# EAGLE design GAME (EAGLE 6.5.0)
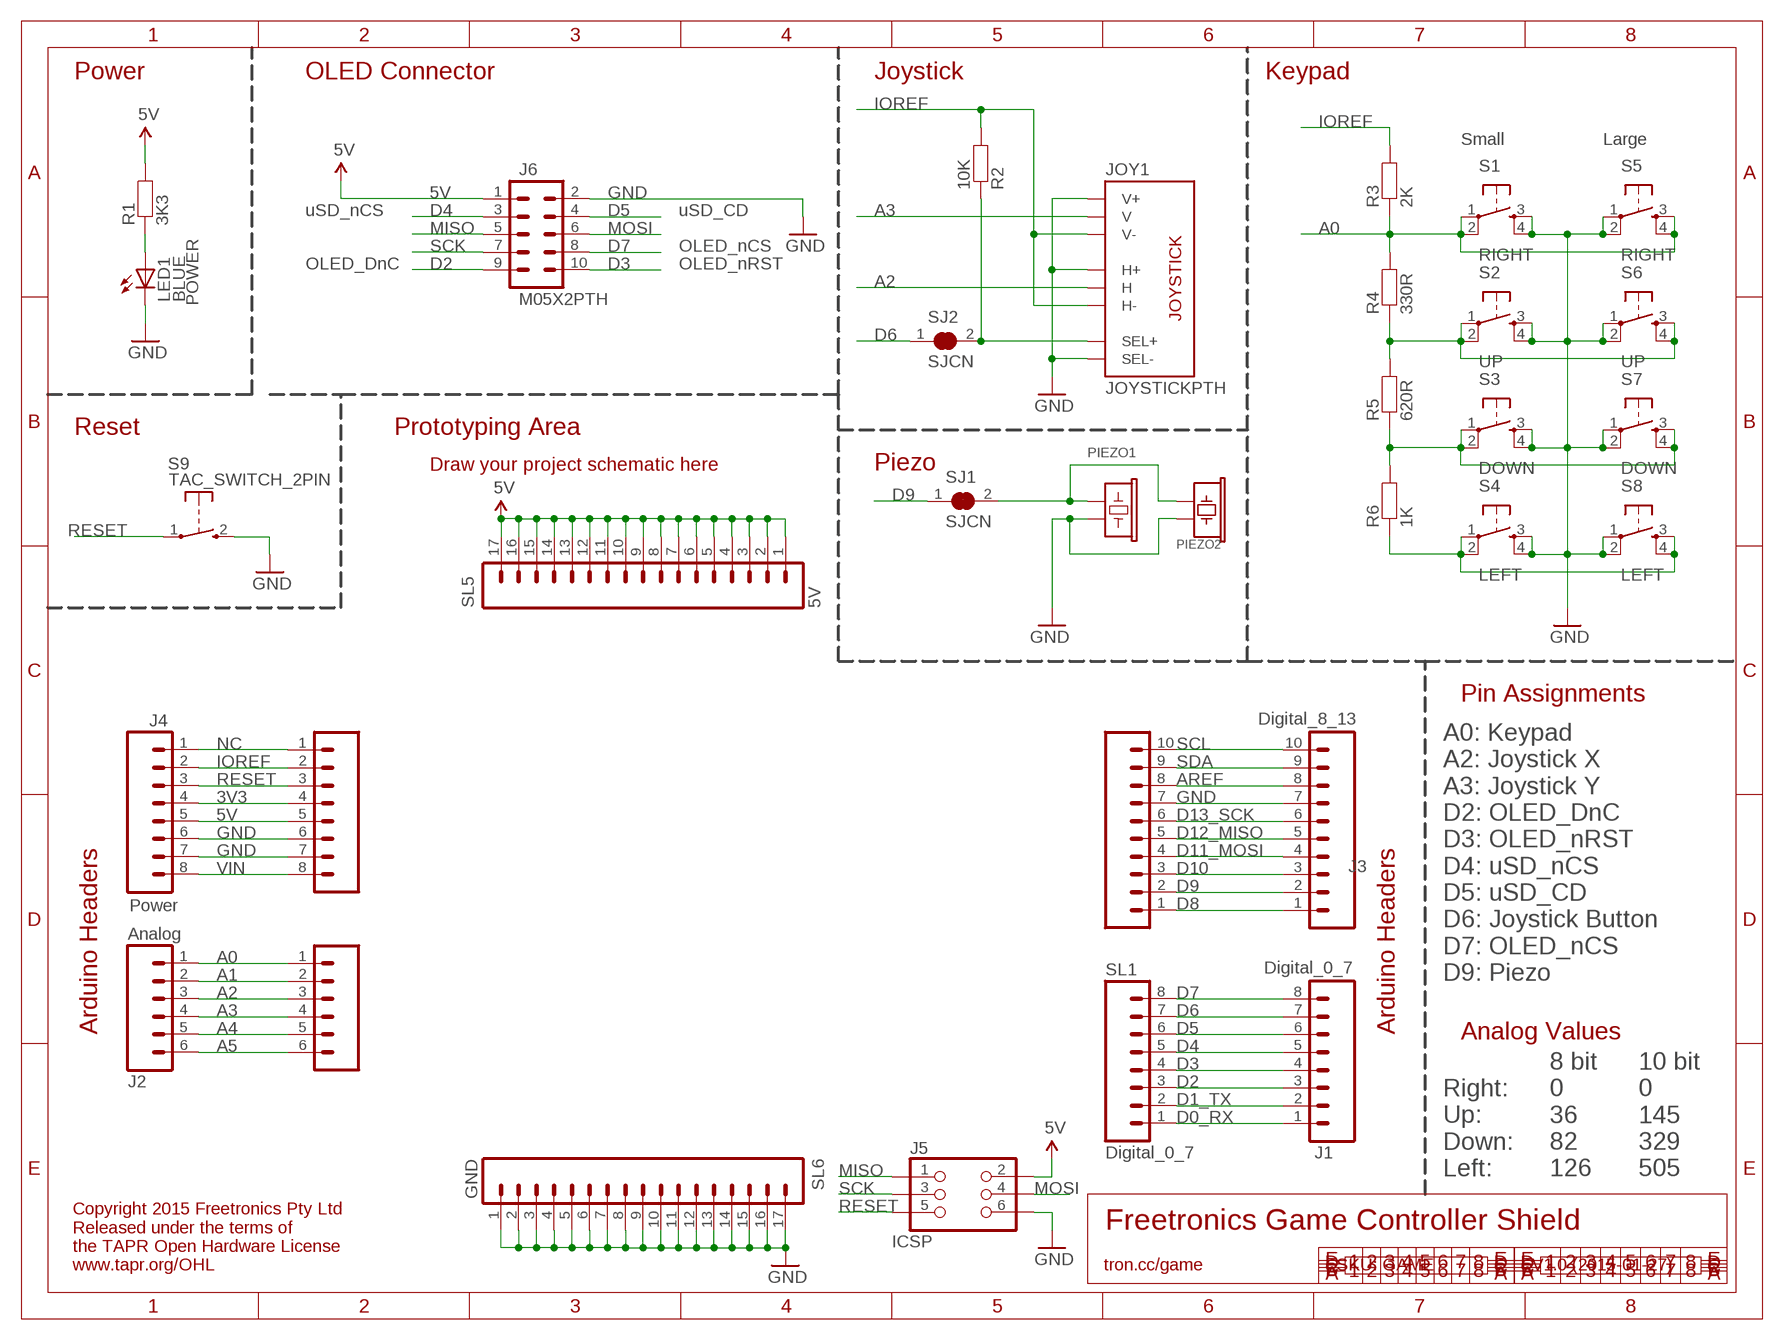
[diagram p0: schematic, sheet 1]

## Parts
J1  Digital_0_7  M08  [1X08]
J2  Analog  M06SIP  [1X06]
J3  Digital_8_13  M100.1  [1X10]
J4  Power  M08  [1X08]
J5  ICSP  ICSPPTH  [2X03PTH]
J6  M05X2PTH  [AVR_ICSP]
JOY1  JOYSTICKPTH  [JOYSTICK]
LED1  BLUE  LED0603  [LED-0603]
PIEZO1  BUZZERSMD12X12  [BUZZER-12X12-SMT]
PIEZO2  PIEZO12MM  [PIEZO12MM]
R1  3K3  RESISTOR0603  [0603]
R2  10K  RESISTOR0603  [0603]
R3  2K  RESISTOR0603  [0603]
R4  330R  RESISTOR0603  [0603]
R5  620R  RESISTOR0603  [0603]
R6  1K  RESISTOR0603  [0603]
S1  RIGHT  TAC_SWITCHPTH  [TACTILE-PTH]
S2  UP  TAC_SWITCHPTH  [TACTILE-PTH]
S3  DOWN  TAC_SWITCHPTH  [TACTILE-PTH]
S4  LEFT  TAC_SWITCHPTH  [TACTILE-PTH]
S5  RIGHT  TAC_SWITCH12  [TACTILE-PTH-12MM]
S6  UP  TAC_SWITCH12  [TACTILE-PTH-12MM]
S7  DOWN  TAC_SWITCH12  [TACTILE-PTH-12MM]
S8  LEFT  TAC_SWITCH12  [TACTILE-PTH-12MM]
S9  TAC_SWITCH_2PIN  [TACTILE_SWITCH_SMD_2PIN_TINY]
SJ1  SJCN  [SJC]
SJ2  SJCN  [SJC]
SL1  Digital_0_7  M08  [1X08]
SL2  Analog  M06SIP  [1X06]
SL3  Digital_8_13  M100.1  [1X10]
SL4  Power  M08  [1X08]
SL5  5V  M17  [1X17]
SL6  GND  M17  [1X17]

## Nets
3V3: J4.4 SL4.4
5V: J4.5 J5.2 J6.1 R1.2 SL4.5 SL5.1 SL5.2 SL5.3 SL5.4 SL5.5 SL5.6 SL5.7 SL5.8 SL5.9 SL5.10 SL5.11 SL5.12 SL5.13 SL5.14 SL5.15 SL5.16 SL5.17
A0: J2.1 R3.1 R4.2 S1.1 S1.2 S5.3 S5.4 SL2.1
A1: J2.2 SL2.2
A2: J2.3 JOY1.H2(H) SL2.3
A3: J2.4 JOY1.V2(V) SL2.4
A4: J2.5 SL2.5
A5: J2.6 SL2.6
AREF: J3.8 SL3.8
D0_RX: J1.1 SL1.1
D1_TX: J1.2 SL1.2
D2: J1.3 J6.9 SL1.3
D3: J1.4 J6.10 SL1.4
D4: J1.5 J6.3 SL1.5
D5: J1.6 J6.4 SL1.6
D6: J1.7 SJ2.1 SL1.7
D7: J1.8 J6.8 SL1.8
D8: J3.1 SL3.1
D9: J3.2 SJ1.1 SL3.2
D10: J3.3 SL3.3
D11_MOSI: J3.4 SL3.4
D12_MISO: J3.5 SL3.5
D13_SCK: J3.6 SL3.6
GND: J3.7 J4.6 J4.7 J5.6 J6.2 JOY1.B2A(SEL-) JOY1.H1(H+) JOY1.V1(V+) LED1.C PIEZO1.1 PIEZO2.2 S1.3 S1.4 S2.3 S2.4 S3.3 S3.4 S4.3 S4.4 S5.1 S5.2 S6.1 S6.2 S7.1 S7.2 S8.1 S8.2 S9.2(S) SL3.7 SL4.6 SL4.7 SL6.1 SL6.2 SL6.3 SL6.4 SL6.5 SL6.6 SL6.7 SL6.8 SL6.9 SL6.10 SL6.11 SL6.12 SL6.13 SL6.14 SL6.15 SL6.16 SL6.17
IOREF: J4.2 JOY1.H3(H-) JOY1.V3(V-) R2.2 R3.2 SL4.2
MISO: J5.1 J6.5
MOSI: J5.4 J6.6
N$14: LED1.A R1.1
N$112: PIEZO1.2 PIEZO2.1 SJ1.2
N$133: JOY1.B1A(SEL+) R2.1 SJ2.2
N$135: R6.1 S4.1 S4.2 S8.3 S8.4
N$136: R5.1 R6.2 S3.1 S3.2 S7.3 S7.4
N$137: R4.1 R5.2 S2.1 S2.2 S6.3 S6.4
NC: J4.1 SL4.1
RESET: J4.3 J5.5 S9.1(P) SL4.3
SCK: J5.3 J6.7
SCL: J3.10 SL3.10
SDA: J3.9 SL3.9
VIN: J4.8 SL4.8

## Notes on the sheet
- Power | OLED Connector | Joystick | Keypad
- Small | Large
- uSD_nCS | uSD_CD
- OLED_nCS
- OLED_DnC | OLED_nRST
- POWER
- Reset | Prototyping Area
- Draw your project schematic here | Piezo
- Pin Assignments
- A0: Keypad
  A2: Joystick X
  A3: Joystick Y
  D2: OLED_DnC
  D3: OLED_nRST
  D4: uSD_nCS
  D5: uSD_CD
  D6: Joystick Button
  D7: OLED_nCS
  D9: Piezo
- Arduino Headers | Arduino Headers | Analog Values
- Right:
  Up:
  Down:
  Left:
- 8 bit
  0
  36
  82
  126
- 10 bit
  0
  145
  329
  505
- Freetronics Game Controller Shield
- Copyright 2015 Freetronics Pty Ltd
  Released under the terms of
  the TAPR Open Hardware License
  www.tapr.org/OHL
- tron.cc/game | SKU: GAME | V1.0 (2015-01-27)

## Library data of the parts
J1 J4 SL4 = freetronics:M08: Header 8 Standard 8-pin 0.1" header. Use with straight break away headers (SKU : PRT-00116), right angle break away headers (PRT-00553), swiss pins (PRT-00743), machine pins (PRT-00117), and female headers (PRT-00115).
J2 SL2 = freetronics:M06: Header 6 Standard 6-pin 0.1" header. Use with straight break away headers (SKU : PRT-00116), right angle break away headers (PRT-00553), swiss pins (PRT-00743), machine pins (PRT-00117), and female headers (PRT-00115). Molex polarized connector foot print use with SKU : PRT-08094 with associated crimp pins and housings. NOTES ON THE VARIANTS LOCK and LOCK_LONGPADS... This footprint was designed to help hold the alignment of a through-hole component (i.e. 6-pin header) while soldering it into place. You may notice that each hole has been shifted either up or down by 0.005 of an inch from it's more standard position (which is a perfectly straight line). This slight alteration caused the pins (the squares in the middle) to touch the edges of the holes. Because they are alternating, it causes a "brace" to hold the component in place. 0.005 has proven to be the perfect amount of "off-center" position when using our standard breakaway headers. Although looks a little odd when you look at the bare footprint, once you have a header in there, the alteration is very hard to notice. Also, if you push a header all the way into place, it is covered up entirely on the bottom side. This idea of altering the position of holes to aid alignment will be further integrated into the Sparkfun Library for other footprints. It can help hold any component with 3 or more connection pins.
J3 SL3 = freetronics-original:M10: Header 10 Standard 10-pin 0.1" header. Use with straight break away headers (SKU : PRT-00116), right angle break away headers (PRT-00553), swiss pins (PRT-00743), machine pins (PRT-00117), and female headers (PRT-00115).
J5 = freetronics-jon:ICSP
J6 = freetronics-original:M05X2: Header 5x2 Standard 10-pin dual row 0.1" header. Commonly used with AVR-ISP. Use with Spark Fun Electronics SKU: PRT-00778
JOY1 = freetronics-original:JOYSTICK: Thumb Joystick Joystick commonly found in PS2 controllers. Two pots and a select switch. Footprint proven. Spark Fun Electronics SKU : COM-09032
LED1 = freetronics-jon:LED: LEDs Standard schematic elements and footprints for 5mm, 3mm, 1206, and 0603 sized LEDs. 5mm - Spark Fun Electronics SKU : COM-00529 (and others)
PIEZO1 = freetronics-master-v1:BUZZER: Buzzer - Piezo Transducer
PIEZO2 = freetronics-jon:PIEZO12MM
R1-R6 = freetronics-jon:RESISTOR: Resistor Basic schematic elements and footprints for 0603, 1206, and PTH 1/10th watt (small) resistors.
S1-S4 = freetronics-master-v1.1:TAC_SWITCH: Momentary Switch Button commonly used for reset or general input. Spark Fun Electronics SKU : COM-00097
S5-S8 = freetronics-jon:TAC_SWITCH: Momentary Switch Button commonly used for reset or general input. Spark Fun Electronics SKU : COM-00097
S9 = freetronics-master-v1.1:TAC_SWITCH_2PIN: Momentary Tactile Switch - 2 pin
SJ1 SJ2 = freetronics-jon:SJC
SL1 = freetronics-original:M08: Header 8 Standard 8-pin 0.1" header. Use with straight break away headers (SKU : PRT-00116), right angle break away headers (PRT-00553), swiss pins (PRT-00743), machine pins (PRT-00117), and female headers (PRT-00115).
SL5 SL6 = freetronics-master-v1.1:M17

## Board
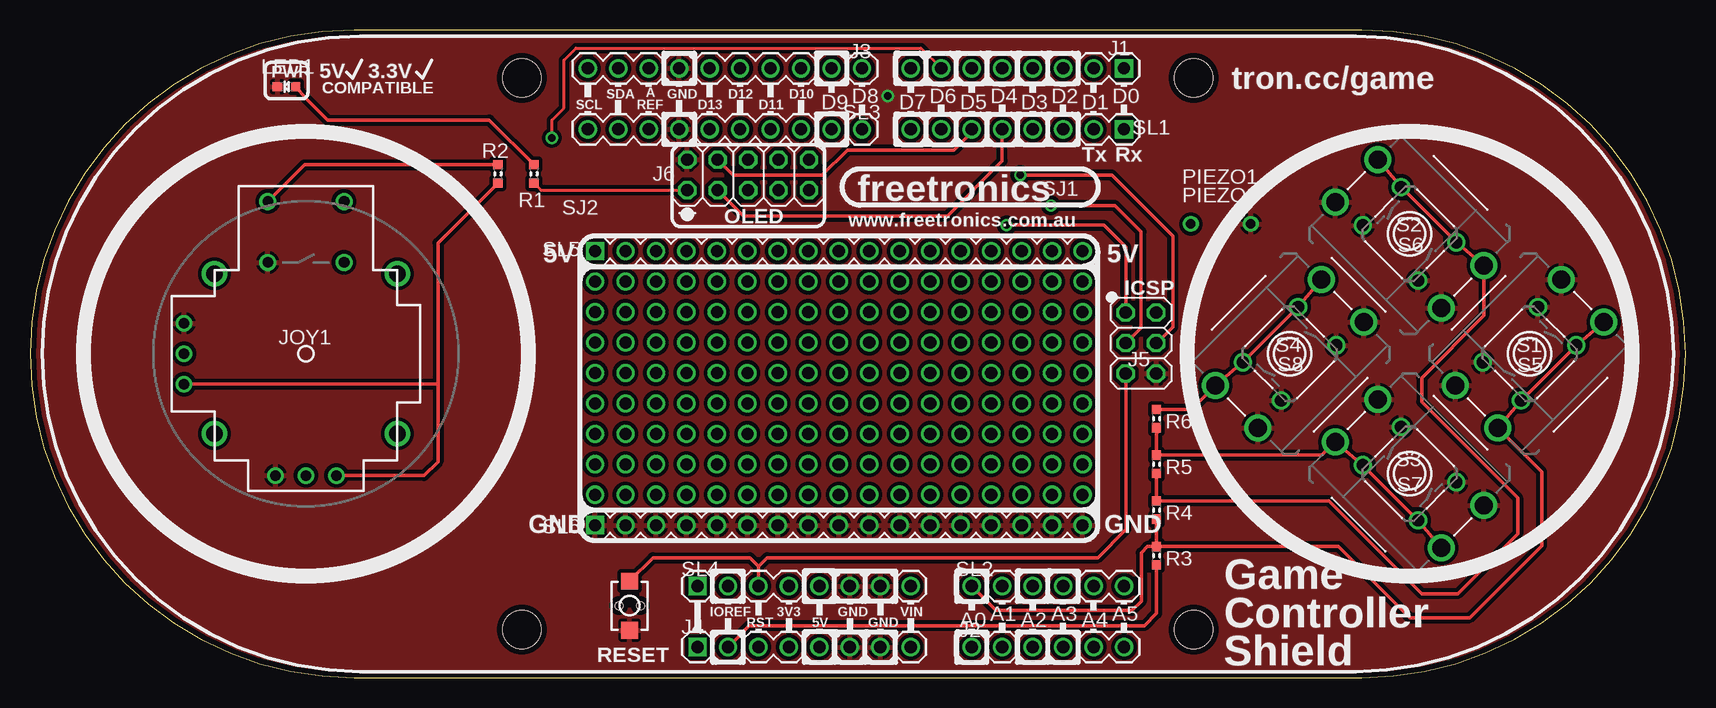
[diagram p1: board, top side]
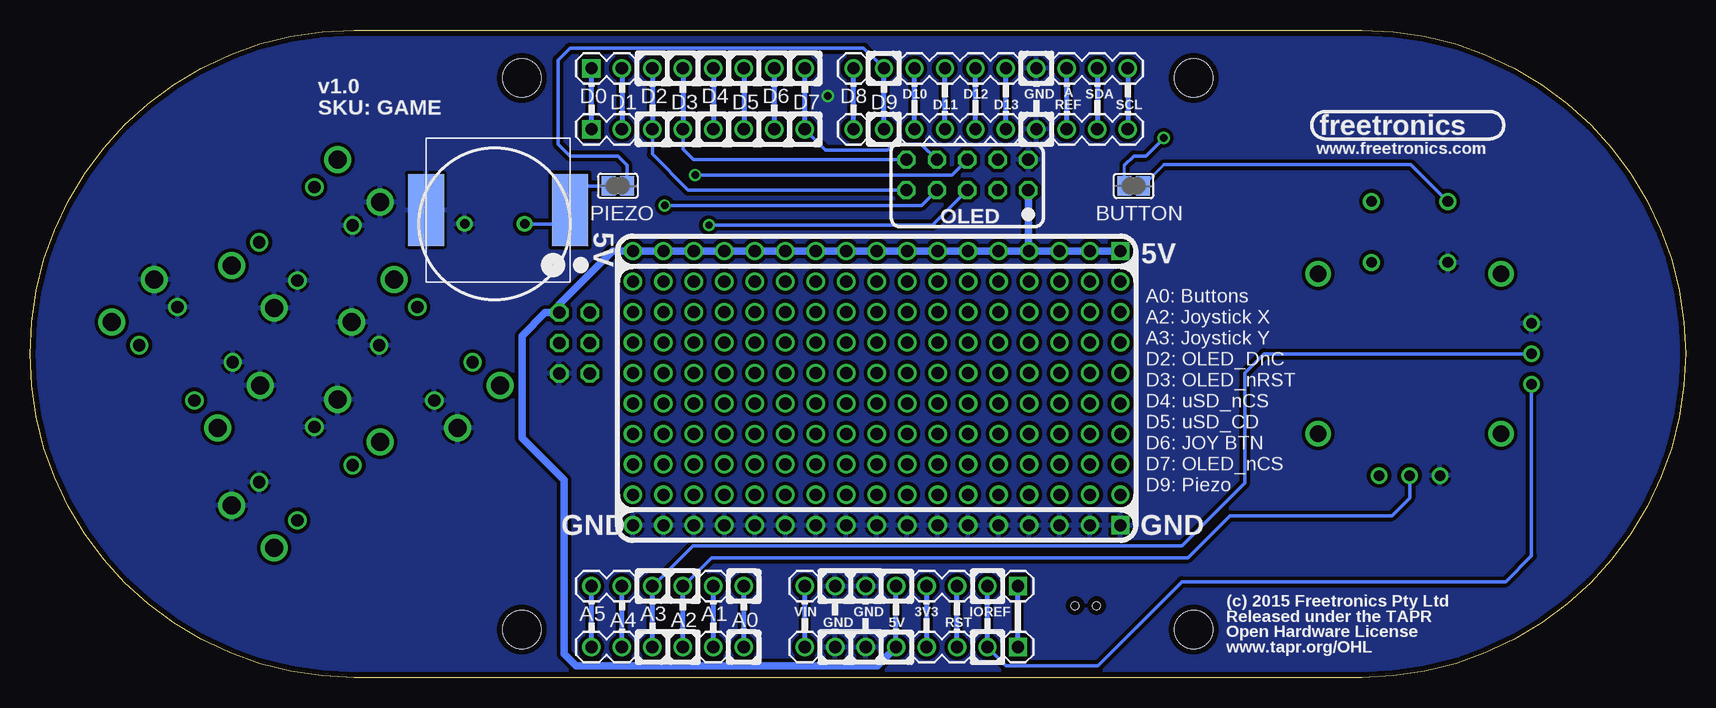
[diagram p2: board, bottom side, seen from below]

Size 138 x 54 mm. Coordinates in mm from the lower left corner, seen from the top.
Outline: 27,54 arc180 27,0 111,0 arc180 111,54 27,54
Copper layers (1*16): Top 0.035mm / dielectric 1.5mm / Bottom 0.035mm
Design rules "default *": minimum track width 10mil, minimum drill 24mil, track to track 12mil, track to pad 12mil, pad to pad 12mil, via to via 12mil, smd to smd 8mil, copper to edge 18mil, drill to drill 8mil, minimum pad ring 10mil, minimum via ring 8mil, stop-mask expansion 4mil, vias tented up to drill 0mil, thermal gap 10mil
Holes 3.2 mm at 41,50 41,4 97,4 97,50

### Footprints (pad centres in the part's own frame; a part is rotated, then mirrored left to right if it is on the bottom)
1X08 = drill 1.016 square: 1 0,0 | drill 1.016: 2 2.54,0; 3 5.08,0; 4 7.62,0; 5 10.16,0; 6 12.7,0; 7 15.24,0; 8 17.78,0
1X06 = drill 1.016: 1 0,0; 2 2.54,0; 3 5.08,0; 4 7.62,0; 5 10.16,0; 6 12.7,0
1X10 = drill 1.016: 1 0,0; 2 2.54,0; 3 5.08,0; 4 7.62,0; 5 10.16,0; 6 12.7,0; 7 15.24,0; 8 17.78,0; 9 20.32,0; 10 22.86,0
2X03PTH = drill 1.016 octagon: 1 -2.54,-1.27; 2 -2.54,1.27; 3 0,-1.27; 4 0,1.27; 5 2.54,-1.27; 6 2.54,1.27
AVR_ICSP = drill 1.016 octagon: 1 -1.27,5.08; 2 1.27,5.08; 3 -1.27,2.54; 4 1.27,2.54; 5 -1.27,0; 6 1.27,0; 7 -1.27,-2.54; 8 1.27,-2.54; 9 -1.27,-5.08; 10 1.27,-5.08
JOYSTICK = drill 0.9: B1A -3.175,12.7; B1B 3.175,12.7; B2A -3.175,7.62; B2B 3.175,7.62 | drill 0.889: H1 -2.54,-10.16; H2 0,-10.16; H3 2.54,-10.16; V1 -10.16,2.54; V2 -10.16,0; V3 -10.16,-2.54 | drill 1.397: MOUNT1 -7.62,6.668; MOUNT2 -7.62,-6.668; MOUNT3 7.62,-6.668; MOUNT4 7.62,6.668
LED-0603 = smd 0.762 x 0.762: A -0.762,0; C 0.762,0
BUZZER-12X12-SMT = smd 3 x 6: 1 -6,0; 2 6,0
PIEZO12MM = drill 0.8: 1 -2.5,0; 2 2.5,0
0603 = smd 0.762 x 0.762: 1 -0.762,0; 2 0.762,0
TACTILE-PTH = drill 1.016: 1 -3.251,2.261; 2 3.251,2.261; 3 -3.251,-2.261; 4 3.251,-2.261
TACTILE-PTH-12MM = drill 1.5: 1 -6.25,2.5; 2 6.25,2.5; 3 -6.25,-2.5; 4 6.25,-2.5
TACTILE_SWITCH_SMD_2PIN_TINY = smd 1.4 x 1.4: 1 -2.05,0; 2 2.05,0 | hole 0.65: 0,0.9; 0,-0.9
SJC = smd 1.168 x 1.6: 1 -0.762,0; 2 0.762,0
1X17 = drill 1.016 square: 1 0,0 | drill 1.016: 2 2.54,0; 3 5.08,0; 4 7.62,0; 5 10.16,0; 6 12.7,0; 7 15.24,0; 8 17.78,0; 9 20.32,0; 10 22.86,0; 11 25.4,0; 12 27.94,0; 13 30.48,0; 14 33.02,0; 15 35.56,0; 16 38.1,0; 17 40.64,0

### Placement (x,y rotation side)
J1  91.2,50.8 180 top
J2  78.5,2.54 0 top
J3  69.36,50.8 180 top
J4  55.64,2.54 0 top
J5  92.61,27.89 270 top
J6  59.86,41.91 90 top
JOY1  23,27 0 top
LED1  21.39,49.27 180 top
PIEZO1  99,39 0 bottom
PIEZO2  99.27,37.83 180 bottom
R1  42,42 270 top
R2  39,42 270 top
R3  93.9,10.16 270 top
R4  93.9,13.97 270 top
R5  93.9,17.78 270 top
R6  93.9,21.59 270 top
S1  125,27 225 top
S2  115,37 315 top
S3  115,17 135 top
S4  105,27 45 top
S5  125,27 45 top
S6  115,37 135 top
S7  115,17 315 top
S8  105,27 225 top
S9  49.98,6 270 top
SJ1  89,41 180 bottom
SJ2  46,41 0 bottom
SL1  91.2,45.72 180 top
SL2  78.5,7.62 0 top
SL3  69.36,45.72 180 top
SL4  55.64,7.62 0 top
SL5  47.1,35.56 0 top
SL6  47.1,12.7 0 top

### Tracks (layer width: path | path; a pad name or v marks a point on that pad's centre or on a via)
3V3
  Bottom 0.406: SL4.4 J4.4
5V
  Top 0.254: R1.2 42.6,40.64 J6.1
  Bottom 0.406: J4.5 SL4.5
  Bottom 0.61: SL5.1 SL5.2 SL5.3 SL5.4 | SL5.4 SL5.5 SL5.6 SL5.7 SL5.8 SL5.9 SL5.10 SL5.11 SL5.12 SL5.13 SL5.14 SL5.15 SL5.16 SL5.17 89.44,35.56 93.88,31.12 J5.2 95.07,30.43 97,28.5 97,20 93.5,16.5 93.5,2 92.5,1 67.34,1 J4.5 | J6.1 54.78,35.62 SL5.4
A0
  Top 0.305: R4.2 R3.1 | R3.1 93.14,10.92 92.63,10.41 92.63,6.35 91.87,5.59 80.53,5.59 SL2.1 | S5.4 S1.1 S1.2 S5.3 126,17.16 126,11 120,5 115,5 109.08,10.92 R3.1
  Bottom 0.406: J2.1 SL2.1
A1
  Bottom 0.406: J2.2 SL2.2
A2
  Bottom 0.305: SL2.3 81.2,10 41.5,10 38,13.5 24.5,13.5 23,15 JOY1.H2
  Bottom 0.406: J2.3 SL2.3
A3
  Bottom 0.305: SL2.4 82.74,11 42,11 36.75,16.25 36.75,25.4 35.15,27 JOY1.V2
  Bottom 0.406: J2.4 SL2.4
A4
  Bottom 0.406: J2.5 SL2.5
A5
  Bottom 0.406: J2.6 SL2.6
AREF
  Bottom 0.406: SL3.8 J3.8
D0_RX
  Bottom 0.406: SL1.1 J1.1
D1_TX
  Bottom 0.406: J1.2 SL1.2
D2
  Bottom 0.305: SL1.3 86.12,43.63 83.13,40.64 J6.9
  Bottom 0.406: J1.3 SL1.3
D3
  Bottom 0.305: SL1.4 83.58,44.08 82.68,43.18 J6.10
  Bottom 0.406: J1.4 SL1.4
D4
  Top 0.305: J6.3 59.46,38.5 76.46,38.5 81.04,43.08 SL1.5
  Bottom 0.406: J1.5 SL1.5
D5
  Top 0.254: SL1.6 78.5,45.5
  Top 0.305: 78.5,45.5 77,44 68.13,44 66.04,41.91 58.59,41.91 J6.4
  Bottom 0.406: J1.6 SL1.6
D6  (via drill 0.6)
  Top 0.254: v43.5,45 43.5,46.5 44.5,47.5 44.5,51.5 45.5,52.5 74.26,52.5 J1.7
  Bottom 0.254: SJ2.1 46.76,42.74
  Bottom 0.305: 46.76,42.74 46,43.5 45,43.5 v43.5,45
  Bottom 0.406: J1.7 SL1.7
D7
  Bottom 0.305: SL1.8 71.7,44 66.54,44 66.04,44.5 63.72,44.5 J6.8
  Bottom 0.406: J1.8 SL1.8
D8
  Bottom 0.406: SL3.1 J3.1
D9
  Bottom 0.305: SJ1.1 88.24,42.74 89,43.5 93,43.5 94,44.5 94,51.5 93,52.5 68.52,52.5 J3.2
  Bottom 0.406: SL3.2 J3.2
D10
  Bottom 0.406: SL3.3 J3.3
D11_MOSI
  Bottom 0.406: SL3.4 J3.4
D12_MISO
  Bottom 0.406: SL3.5 J3.5
D13_SCK
  Bottom 0.406: SL3.6 J3.6
GND  (via drill 0.6)
  other vias: 71.5,48.5
  pour Bottom: 27,54 111,54 arc-180 111,0 27,0 arc-180
  pour Top: 27,54 111,54 arc-180 111,0 27,0 arc-180
IOREF
  Top 0.305: R3.2 93.9,5.33 92.88,4.32 59.96,4.32 J4.2 | R2.2 34,36.24 34,24.46 | 34,24.46 34,18 32.84,16.84 JOY1.H3 | JOY1.V3 34,24.46
  Bottom 0.305: J4.2 56.64,1 49,1 42,8 15,8 12.84,10.16 JOY1.V3
  Bottom 0.406: J4.2 SL4.2
MISO  (via drill 0.6)
  Top 0.305: J5.1 91.34,35.91 89.53,37.72 v81.41,37.72
  Bottom 0.305: J6.5 62.78,37.72 v81.41,37.72
MOSI  (via drill 0.6)
  Top 0.305: J5.4 93.93,27.89 95.25,29.21 95.25,36.83 90.17,41.91 v82.55,41.91
  Bottom 0.305: J6.6 61.13,41.91 v82.55,41.91
N$1  (via drill 1.02)
  other vias: 67.42,15.24
N$2  (via drill 1.02)
  other vias: 64.88,15.24
N$3  (via drill 1.02)
  other vias: 67.42,17.78
N$4  (via drill 1.02)
  other vias: 64.88,17.78
N$5  (via drill 1.02)
  other vias: 59.8,27.94
N$6  (via drill 1.02)
  other vias: 57.26,27.94
N$7  (via drill 1.02)
  other vias: 59.8,30.48
N$8  (via drill 1.02)
  other vias: 57.26,30.48
N$9  (via drill 1.02)
  other vias: 59.8,33.02
N$10  (via drill 1.02)
  other vias: 57.26,33.02
N$11  (via drill 1.02)
  other vias: 54.72,27.94
N$12  (via drill 1.02)
  other vias: 62.34,22.86
N$13  (via drill 1.02)
  other vias: 59.8,22.86
N$14
  Top 0.305: LED1.A 23.03,48.27 24.82,46.48 38.28,46.48 R1.1
N$15  (via drill 1.02)
  other vias: 72.5,30.48
N$16  (via drill 1.02)
  other vias: 69.96,30.48
N$17  (via drill 1.02)
  other vias: 52.18,27.94
N$18  (via drill 1.02)
  other vias: 77.58,22.86
N$19  (via drill 1.02)
  other vias: 75.04,22.86
N$20  (via drill 1.02)
  other vias: 77.58,25.4
N$21  (via drill 1.02)
  other vias: 54.72,30.48
N$22  (via drill 1.02)
  other vias: 52.18,30.48
N$23  (via drill 1.02)
  other vias: 54.72,33.02
N$24  (via drill 1.02)
  other vias: 52.18,33.02
N$25  (via drill 1.02)
  other vias: 57.26,17.78
N$26  (via drill 1.02)
  other vias: 54.72,17.78
N$27  (via drill 1.02)
  other vias: 57.26,20.32
N$28  (via drill 1.02)
  other vias: 75.04,25.4
N$29  (via drill 1.02)
  other vias: 77.58,27.94
N$30  (via drill 1.02)
  other vias: 75.04,27.94
N$31  (via drill 1.02)
  other vias: 77.58,30.48
N$32  (via drill 1.02)
  other vias: 75.04,30.48
N$33  (via drill 1.02)
  other vias: 72.5,22.86
N$34  (via drill 1.02)
  other vias: 69.96,22.86
N$35  (via drill 1.02)
  other vias: 72.5,25.4
N$36  (via drill 1.02)
  other vias: 69.96,25.4
N$37  (via drill 1.02)
  other vias: 54.72,20.32
N$38  (via drill 1.02)
  other vias: 57.26,22.86
N$39  (via drill 1.02)
  other vias: 54.72,22.86
N$40  (via drill 1.02)
  other vias: 52.18,17.78
N$41  (via drill 1.02)
  other vias: 62.34,27.94
N$42  (via drill 1.02)
  other vias: 52.18,20.32
N$43  (via drill 1.02)
  other vias: 62.34,30.48
N$44  (via drill 1.02)
  other vias: 67.42,20.32
N$45  (via drill 1.02)
  other vias: 64.88,20.32
N$46  (via drill 1.02)
  other vias: 52.18,22.86
N$47  (via drill 1.02)
  other vias: 72.5,27.94
N$48  (via drill 1.02)
  other vias: 69.96,27.94
N$49  (via drill 1.02)
  other vias: 62.34,33.02
N$50  (via drill 1.02)
  other vias: 59.8,25.4
N$51  (via drill 1.02)
  other vias: 57.26,25.4
N$52  (via drill 1.02)
  other vias: 54.72,25.4
N$53  (via drill 1.02)
  other vias: 52.18,25.4
N$54  (via drill 1.02)
  other vias: 57.26,15.24
N$55  (via drill 1.02)
  other vias: 54.72,15.24
N$56  (via drill 1.02)
  other vias: 52.18,15.24
N$57  (via drill 1.02)
  other vias: 62.34,25.4
N$58  (via drill 1.02)
  other vias: 77.58,15.24
N$59  (via drill 1.02)
  other vias: 75.04,15.24
N$60  (via drill 1.02)
  other vias: 77.58,17.78
N$61  (via drill 1.02)
  other vias: 75.04,17.78
N$62  (via drill 1.02)
  other vias: 77.58,20.32
N$63  (via drill 1.02)
  other vias: 75.04,20.32
N$64  (via drill 1.02)
  other vias: 72.5,15.24
N$65  (via drill 1.02)
  other vias: 69.96,15.24
N$66  (via drill 1.02)
  other vias: 72.5,17.78
N$67  (via drill 1.02)
  other vias: 69.96,17.78
N$68  (via drill 1.02)
  other vias: 72.5,20.32
N$69  (via drill 1.02)
  other vias: 69.96,20.32
N$70  (via drill 1.02)
  other vias: 67.42,33.02
N$71  (via drill 1.02)
  other vias: 64.88,33.02
N$72  (via drill 1.02)
  other vias: 72.5,33.02
N$73  (via drill 1.02)
  other vias: 69.96,33.02
N$74  (via drill 1.02)
  other vias: 77.58,33.02
N$75  (via drill 1.02)
  other vias: 75.04,33.02
N$76  (via drill 1.02)
  other vias: 49.64,27.94
N$77  (via drill 1.02)
  other vias: 47.1,27.94
N$78  (via drill 1.02)
  other vias: 49.64,30.48
N$79  (via drill 1.02)
  other vias: 47.1,30.48
N$80  (via drill 1.02)
  other vias: 49.64,33.02
N$81  (via drill 1.02)
  other vias: 47.1,33.02
N$82  (via drill 1.02)
  other vias: 49.64,17.78
N$83  (via drill 1.02)
  other vias: 49.64,20.32
N$84  (via drill 1.02)
  other vias: 49.64,22.86
N$85  (via drill 1.02)
  other vias: 47.1,17.78
N$86  (via drill 1.02)
  other vias: 47.1,20.32
N$87  (via drill 1.02)
  other vias: 47.1,22.86
N$88  (via drill 1.02)
  other vias: 49.64,25.4
N$89  (via drill 1.02)
  other vias: 47.1,25.4
N$90  (via drill 1.02)
  other vias: 67.42,22.86
N$91  (via drill 1.02)
  other vias: 64.88,22.86
N$92  (via drill 1.02)
  other vias: 49.64,15.24
N$93  (via drill 1.02)
  other vias: 47.1,15.24
N$94  (via drill 1.02)
  other vias: 80.12,25.4
N$95  (via drill 1.02)
  other vias: 80.12,27.94
N$96  (via drill 1.02)
  other vias: 80.12,30.48
N$97  (via drill 1.02)
  other vias: 80.12,33.02
N$98  (via drill 1.02)
  other vias: 80.12,17.78
N$99  (via drill 1.02)
  other vias: 80.12,20.32
N$100  (via drill 1.02)
  other vias: 80.12,22.86
N$101  (via drill 1.02)
  other vias: 80.12,15.24
N$102  (via drill 1.02)
  other vias: 82.66,25.4
N$103  (via drill 1.02)
  other vias: 82.66,27.94
N$104  (via drill 1.02)
  other vias: 82.66,30.48
N$105  (via drill 1.02)
  other vias: 82.66,33.02
N$106  (via drill 1.02)
  other vias: 67.42,25.4
N$107  (via drill 1.02)
  other vias: 64.88,25.4
N$108  (via drill 1.02)
  other vias: 82.66,17.78
N$109  (via drill 1.02)
  other vias: 82.66,20.32
N$110  (via drill 1.02)
  other vias: 82.66,22.86
N$111  (via drill 1.02)
  other vias: 82.66,15.24
N$112
  Bottom 0.254: 92.81,41 93.17,40.64 93.17,39.17 PIEZO1.2 93.17,37.83
  Bottom 0.305: SJ1.2 92.81,41 | 93.17,37.83 PIEZO2.1
N$113  (via drill 1.02)
  other vias: 85.2,25.4
N$114  (via drill 1.02)
  other vias: 85.2,27.94
N$115  (via drill 1.02)
  other vias: 85.2,30.48
N$116  (via drill 1.02)
  other vias: 85.2,33.02
N$117  (via drill 1.02)
  other vias: 85.2,17.78
N$118  (via drill 1.02)
  other vias: 85.2,20.32
N$119  (via drill 1.02)
  other vias: 85.2,22.86
N$120  (via drill 1.02)
  other vias: 85.2,15.24
N$121  (via drill 1.02)
  other vias: 87.74,25.4
N$122  (via drill 1.02)
  other vias: 67.42,27.94
N$123  (via drill 1.02)
  other vias: 64.88,27.94
N$124  (via drill 1.02)
  other vias: 87.74,27.94
N$125  (via drill 1.02)
  other vias: 87.74,30.48
N$126  (via drill 1.02)
  other vias: 87.74,33.02
N$127  (via drill 1.02)
  other vias: 87.74,17.78
N$128  (via drill 1.02)
  other vias: 87.74,20.32
N$129  (via drill 1.02)
  other vias: 87.74,22.86
N$130  (via drill 1.02)
  other vias: 87.74,15.24
N$133
  Top 0.305: R2.1 22.89,42.76 JOY1.B1A
  Bottom 0.254: SJ2.2 43.48,42.76
  Bottom 0.305: 43.48,42.76 22.89,42.76 JOY1.B1A
N$135
  Top 0.305: S8.3 S4.2 S4.1 S8.4 96.82,22.35 R6.1
N$136
  Top 0.254: R6.2 93.9,20.32 94.13,20.55
  Top 0.305: 93.9,20.32 R5.1 107.7,18.54 S7.3 | S7.4 S3.1 S3.2 S7.3 | S7.3 108.65,19.65
N$137
  Top 0.305: R5.2 R4.1 108.27,14.73 116,7 119,7 124,12 124,15 116,23 116,25 121.19,30.19 S6.3 S2.2 S2.1 S6.4
N$138  (via drill 1.02)
  other vias: 67.42,30.48
N$139  (via drill 1.02)
  other vias: 64.88,30.48
N$140  (via drill 1.02)
  other vias: 62.34,15.24
N$141  (via drill 1.02)
  other vias: 59.8,15.24
N$156  (via drill 1.02)
  other vias: 62.34,17.78
N$157  (via drill 1.02)
  other vias: 59.8,17.78
N$172  (via drill 1.02)
  other vias: 62.34,20.32
N$173  (via drill 1.02)
  other vias: 59.8,20.32
NC
  Bottom 0.406: J4.1 SL4.1
RESET
  Top 0.305: S9.1 51.93,10 60,10 60.72,9.28 | SL4.3 60.72,9.28 | J5.5 91.34,12.34 89,10 61.44,10 60.72,9.28
  Bottom 0.406: J4.3 SL4.3
SCK  (via drill 0.6)
  Top 0.305: 91.39,27.89 J5.3 92.61,29.16 92.61,37.18 90.42,39.37 v85.09,39.37
  Bottom 0.305: v85.09,39.37 63.67,39.37 J6.7
SCL
  Bottom 0.406: J3.10 SL3.10
SDA
  Bottom 0.406: J3.9 SL3.9
VIN
  Bottom 0.406: SL4.8 J4.8

### Text on the board
tPlace: PWR | 5V | 3.3V | COMPATIBLE | tron.cc/game | SDA | A | GND | D12 | D10 | D8 | D6 | D4 | D2 | D0 | SCL | REF | D13 | D11 | D9 | D7 | D5 | D3 | D1 | Tx | Rx | freetronics | OLED | www.freetronics.com.au | 5V | 5V | ICSP | GND | GND | IOREF | 3V3 | GND | VIN | A1 | A3 | A5 | RST | 5V | GND | A0 | A2 | A4 | RESET | Game / Controller / Shield
bPlace: v1.0 | SDA | A | GND | D12 | D10 | D8 | D6 | D4 | D2 | D0 | SCL | REF | D13 | D11 | D9 | D7 | D5 | D3 | D1 | SKU: GAME | freetronics | www.freetronics.com | BUTTON | OLED | PIEZO | 5V | 5V | A0: Buttons / A2: Joystick X / A3: Joystick Y / D2: OLED_DnC / D3: OLED_nRST / D4: uSD_nCS / D5: uSD_CD / D6: JOY BTN / D7: OLED_nCS / D9: Piezo | GND | GND | IOREF | 3V3 | GND | VIN | A1 | A3 | A5 | RST | 5V | GND | A0 | A2 | A4 | (c) 2015 Freetronics Pty Ltd / Released under the TAPR / Open Hardware License / www.tapr.org/OHL
tNames: PIEZO1
Document: 1 x 330R 0603 / 1 x 620R 0603 / 1 x 1K 0603 / 1 x 2K 0603 / 1 x 3K3 0603 / 1 x 10K 0603 / 1 x BLUE LED 0603 / 1 x JOYSTICK / 4 x PTH TACT BUTTON / 1 x TINY SMT TACT BUTTON
tDocu: K | A